# Altium schematic sheet 1_shkb_pro3_lite_top.SchDoc: =ProjectTitle
size A4; Address1: github.com/4pplet/SHKB; Address2: Licence: CERN-OHL-S; SheetNumber: 1; SheetTotal: 3
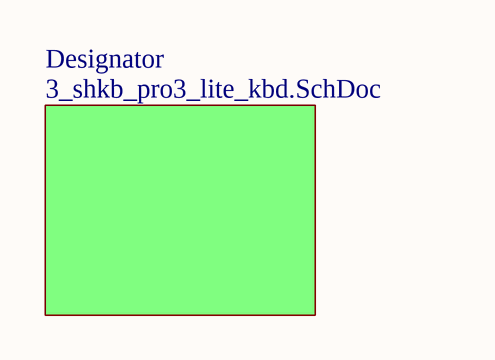
[diagram p0: 1_shkb_pro3_lite_top.SchDoc]

## Sub-sheets
Designator = 3_shkb_pro3_lite_kbd.SchDoc: no entries

## Notes on the sheet
- Title
- Size:
- Date:
- A4
- Number:
- Time:
- Revision:
- Sheet
- of
- File: